# Altium schematic sheet docking_connector_v2.SchDoc
size A; SheetNumber: 1; SheetTotal: 1
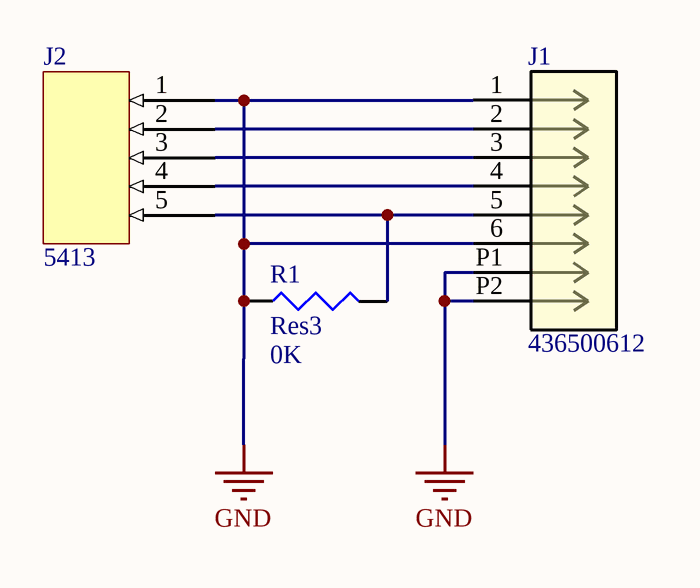
[diagram p0: docking_connector_v2.SchDoc]

## Parts
J1  436500612  [CON_436500612]
J2  5413  [5413]
R1  Res3  value 0K  [J1-0603]

## Nets
GND: J1.1 J1.6 J1.P1 J1.P2 J2.1 R1.1
NetJ1_2: J1.2 J2.2
NetJ1_3: J1.3 J2.3
NetJ1_4: J1.4 J2.4
NetJ1_5: J1.5 J2.5 R1.2

## Library data of the parts
J1 = 436500612: No Description Available; Mfr_Name: Molex Connector Corporation; Copyright: Copyright (C) 2023 Ultra Librarian. All rights reserved.; Manufacturer_Part_Number: 436500612; RefDes: RefDes; Type: DEV
R1 = Res3: Resistor; Published: 8-Jun-2000; LatestRevisionDate: 29-May-2009; LatestRevisionNote: IPC-7351 Footprint Added.; PackageReference: J1-0603; Publisher: Altium Limited; PackageDescription: Chip Resistor